# EasyEDA schematic 1-Schematic_FFF_PCB_Connector.json
TITLE: Sheet_1; REV: 1.0; Date: 2021-05-11; Sheet: 1/1; Company: Your Company
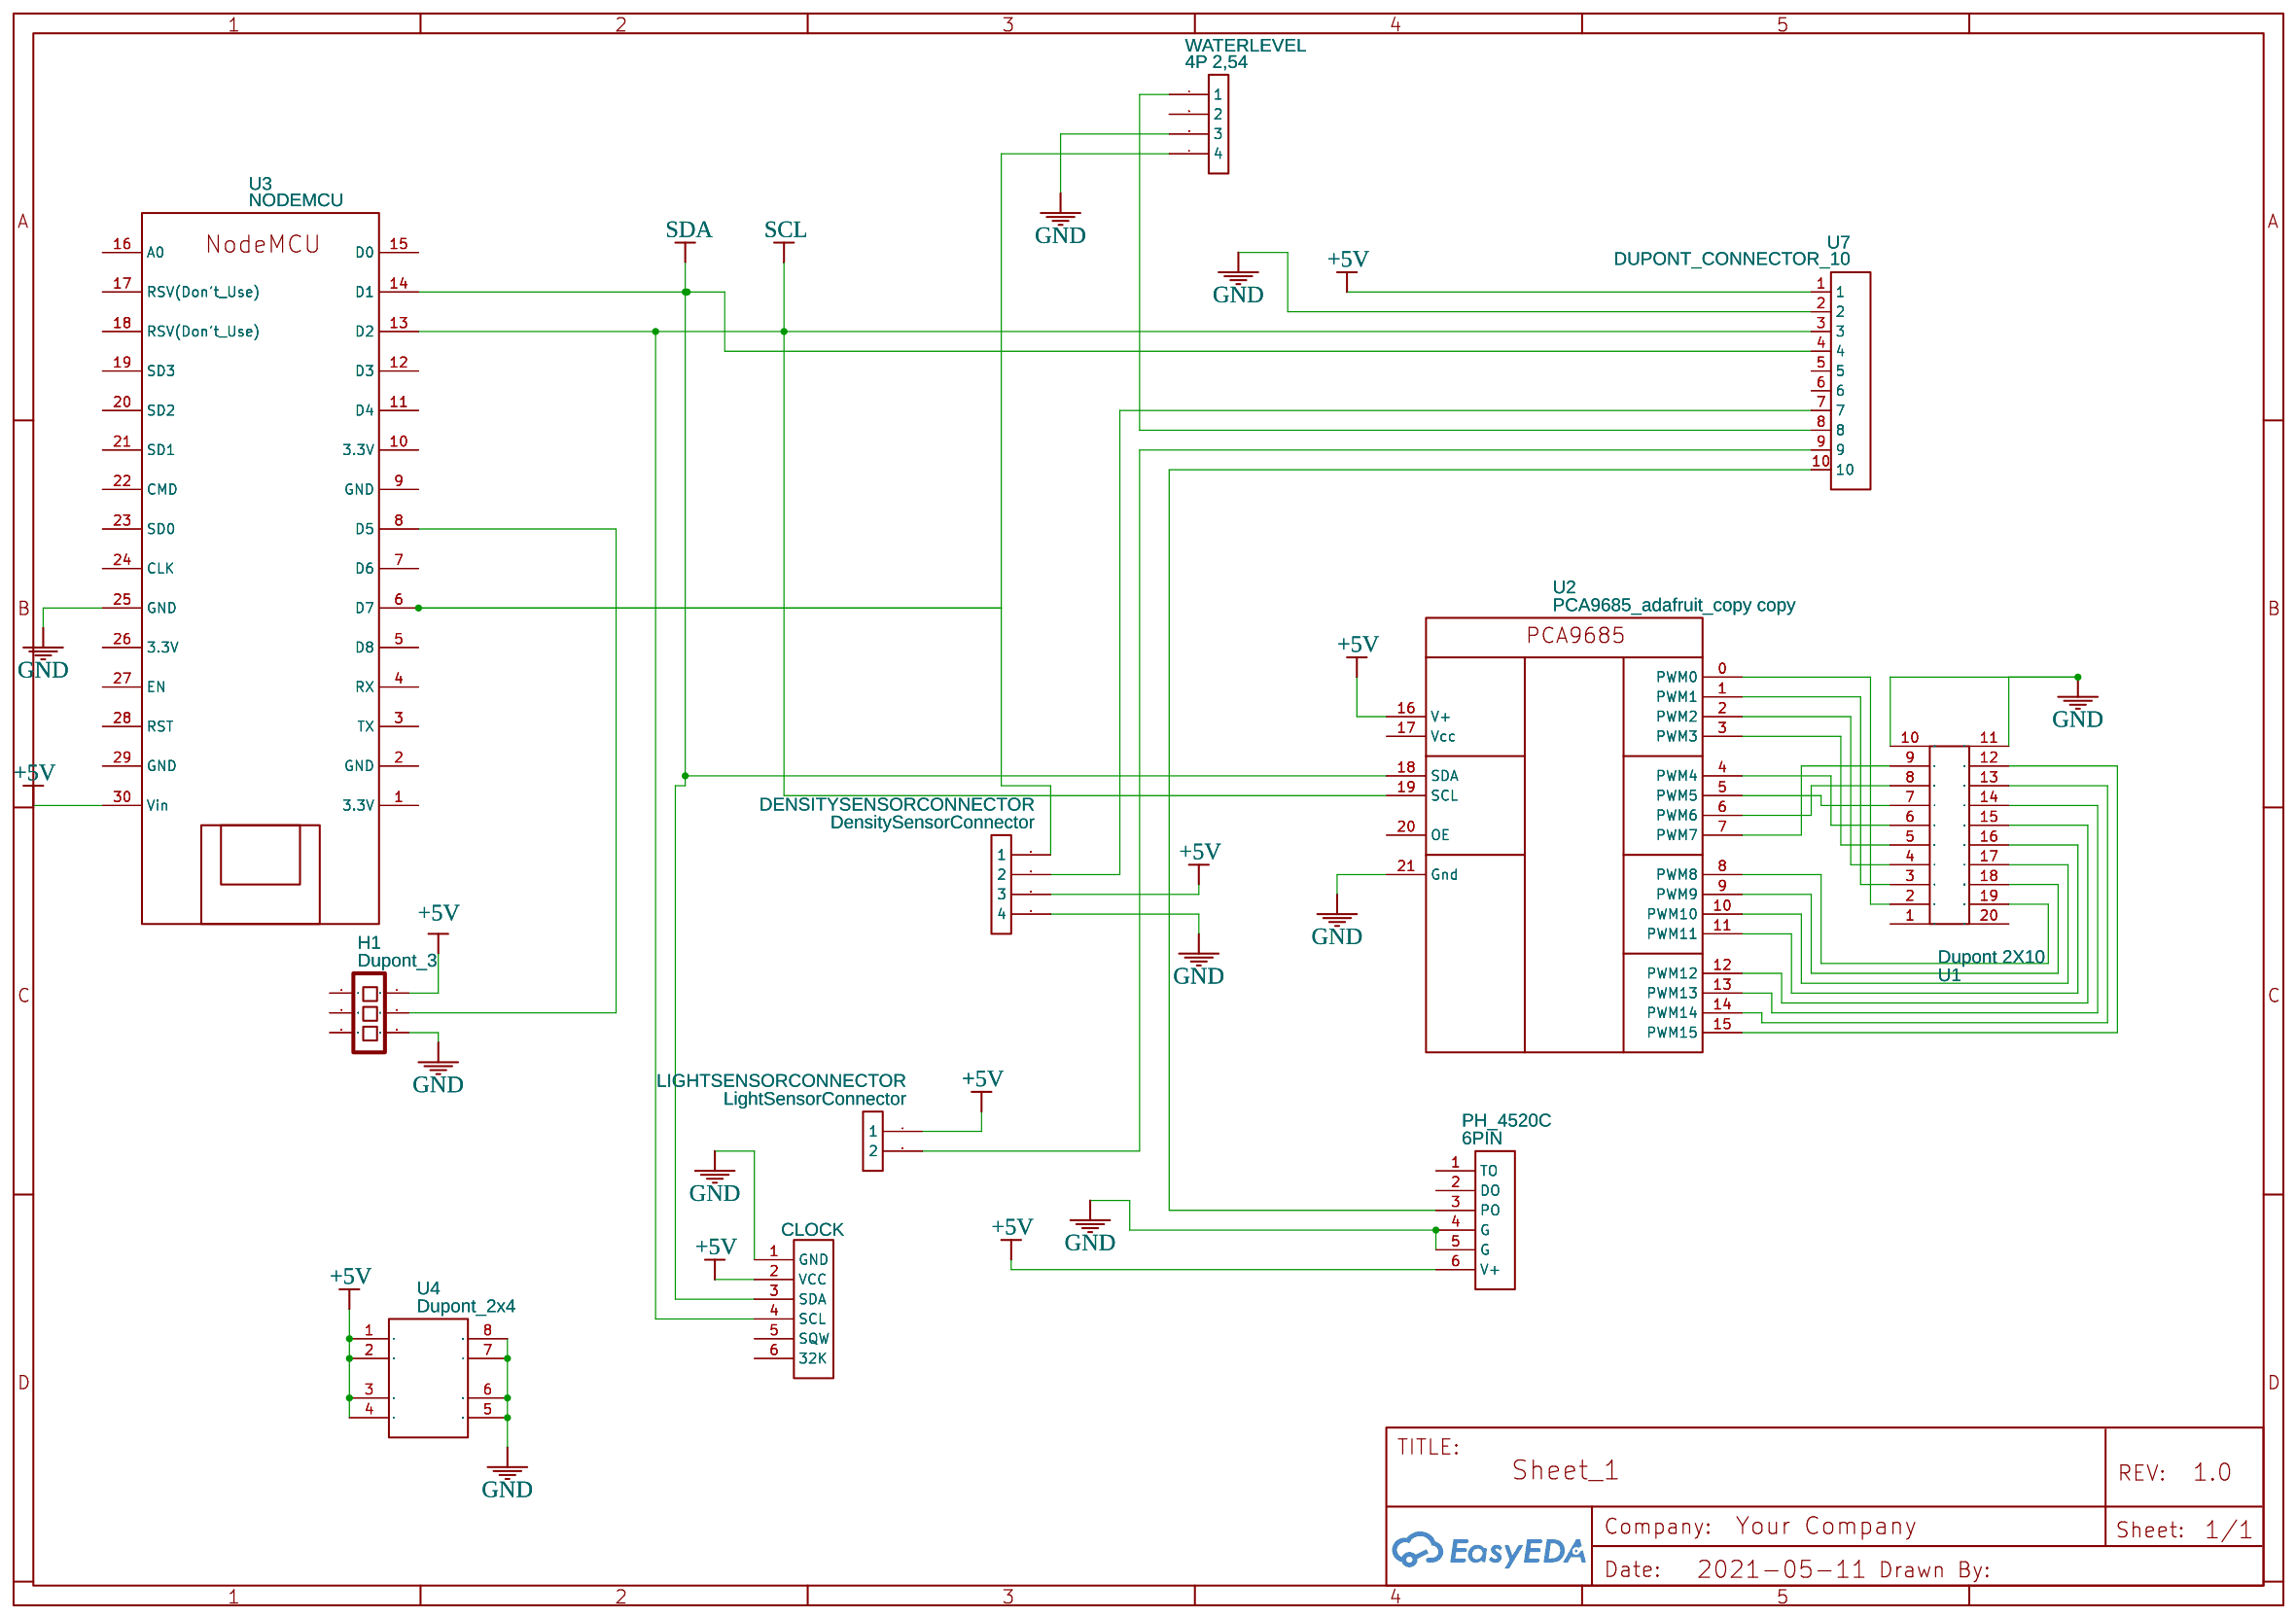
[diagram p0: schematic sheet]

## Parts
CLOCK  6PIN  [6PIN]
DENSITYSENSORCONNECTOR  DensitySensorConnector  [4P*2.54]
H1  Dupont_3  [3PIN DUPONT]
LIGHTSENSORCONNECTOR  LightSensorConnector  [DUPONT_1X2]
PH_4520C  6PIN  [6PIN]
U1  Dupont 2X10  [DUPONT 2X10 FP]
U2  PCA9685_adafruit_copy copy  [PCA9685 ADAFRUIT]
U3  NODEMCU  [ESP12E_DEVKIT-V1]
U4  Dupont_2x4  [DUPONT_2X4]
U7  DUPONT_CONNECTOR_10  [ON5CG_CONN_10_1]
WATERLEVEL  4P 2,54  [4P*2.54]

## Library data of the parts
CLOCK PH_4520C = 6PIN: catid: 20; Contributor: Rekin2137; sim: true
DENSITYSENSORCONNECTOR WATERLEVEL = 4P 2,54: Manufacturer Part: Conector_dupont; Contributor: hector.mc1988
H1 = Dupont_3: Contributor: dluzewski.jan
LIGHTSENSORCONNECTOR = Dupont_1x2: Manufacturer Part: Conector_dupont; Contributor: invenitec
U1 = Dupont 2X10: Contributor: sebidouilleur
U2 = PCA9685_adafruit_copy copy: Contributor: KOXOV
U3 = NODEMCU: Contributor: canda410; sourceId: OGtr1ZXUS
U4 = Dupont_2x4: Manufacturer Part: Custom; Contributor: invenitec
U7 = DUPONT_CONNECTOR_10: Contributor: Christian GILSON

## Nets
+5V: CLOCK.2(VCC) DENSITYSENSORCONNECTOR.3 H1.1 LIGHTSENSORCONNECTOR.1 PH_4520C.6(V+) U2.16(V+) U3.30(Vin) U4.1 U4.2 U4.3 U4.4 U7.1
GND: CLOCK.1(GND) DENSITYSENSORCONNECTOR.4 H1.3 PH_4520C.4(G) PH_4520C.5(G) U1.10 U1.11(1) U2.21(Gnd) U3.25(GND) U4.5 U4.6 U4.7 U4.8 U7.2 WATERLEVEL.3
SCL: CLOCK.4(SCL) U2.19(SCL) U3.13(D2) U7.3
SDA: CLOCK.3(SDA) U2.18(SDA) U3.14(D1) U7.4
Net-(DENSITYSENSORCONNECTOR-1): DENSITYSENSORCONNECTOR.1 U3.6(D7) WATERLEVEL.4
Net-(DENSITYSENSORCONNECTOR-2): DENSITYSENSORCONNECTOR.2 U7.7
Net-(H1-2): H1.2 U3.8(D5)
Net-(LIGHTSENSORCONNECTOR-2): LIGHTSENSORCONNECTOR.2 U7.9
Net-(PH_4520C-3): PH_4520C.3(PO) U7.10
Net-(U1-2): U1.2 U2.0(PWM0)
Net-(U1-3): U1.3 U2.1(PWM1)
Net-(U1-4): U1.4 U2.2(PWM2)
Net-(U1-5): U1.5 U2.3(PWM3)
Net-(U1-6): U1.6 U2.4(PWM4)
Net-(U1-7): U1.7 U2.5(PWM5)
Net-(U1-8): U1.8 U2.6(PWM6)
Net-(U1-9): U1.9 U2.7(PWM7)
Net-(U1-12): U1.12(2) U2.15(PWM15)
Net-(U1-13): U1.13(3) U2.14(PWM14)
Net-(U1-14): U1.14(4) U2.13(PWM13)
Net-(U1-15): U1.15(5) U2.12(PWM12)
Net-(U1-16): U1.16(6) U2.11(PWM11)
Net-(U1-17): U1.17(7) U2.10(PWM10)
Net-(U1-18): U1.18(8) U2.9(PWM9)
Net-(U1-19): U1.19(9) U2.8(PWM8)
Net-(U7-8): U7.8 WATERLEVEL.1

Not connected (* = marked no-connect by the designer): CLOCK 5(SQW) 6(32K); PH_4520C 1(TO) 2(DO); U1 1 20(10); U2 17(Vcc) 20(OE); U3 1(3.3V) 2(GND) 3(TX) 4(RX) 5(D8) 7(D6) 9(GND) 10(3.3V) 11(D4) 12(D3) 15(D0) 16(A0) 17(RSV(Don't Use)) 18(RSV(Don't Use)) 19(SD3) 20(SD2) 21(SD1) 22(CMD) 23(SD0) 24(CLK) 26(3.3V) 27(EN) 28(RST) 29(GND); U7 5 6; WATERLEVEL 2
